# EAGLE board Z80_BMO_V1.2 (EAGLE 6.6.0), part 1 of 2
DRAWING_NUMBER: S002_B003; DRAWN: Mario Blunk / Blunk electronic; PROJECT: System TRAIN-Z; STATUS: PRODUCT
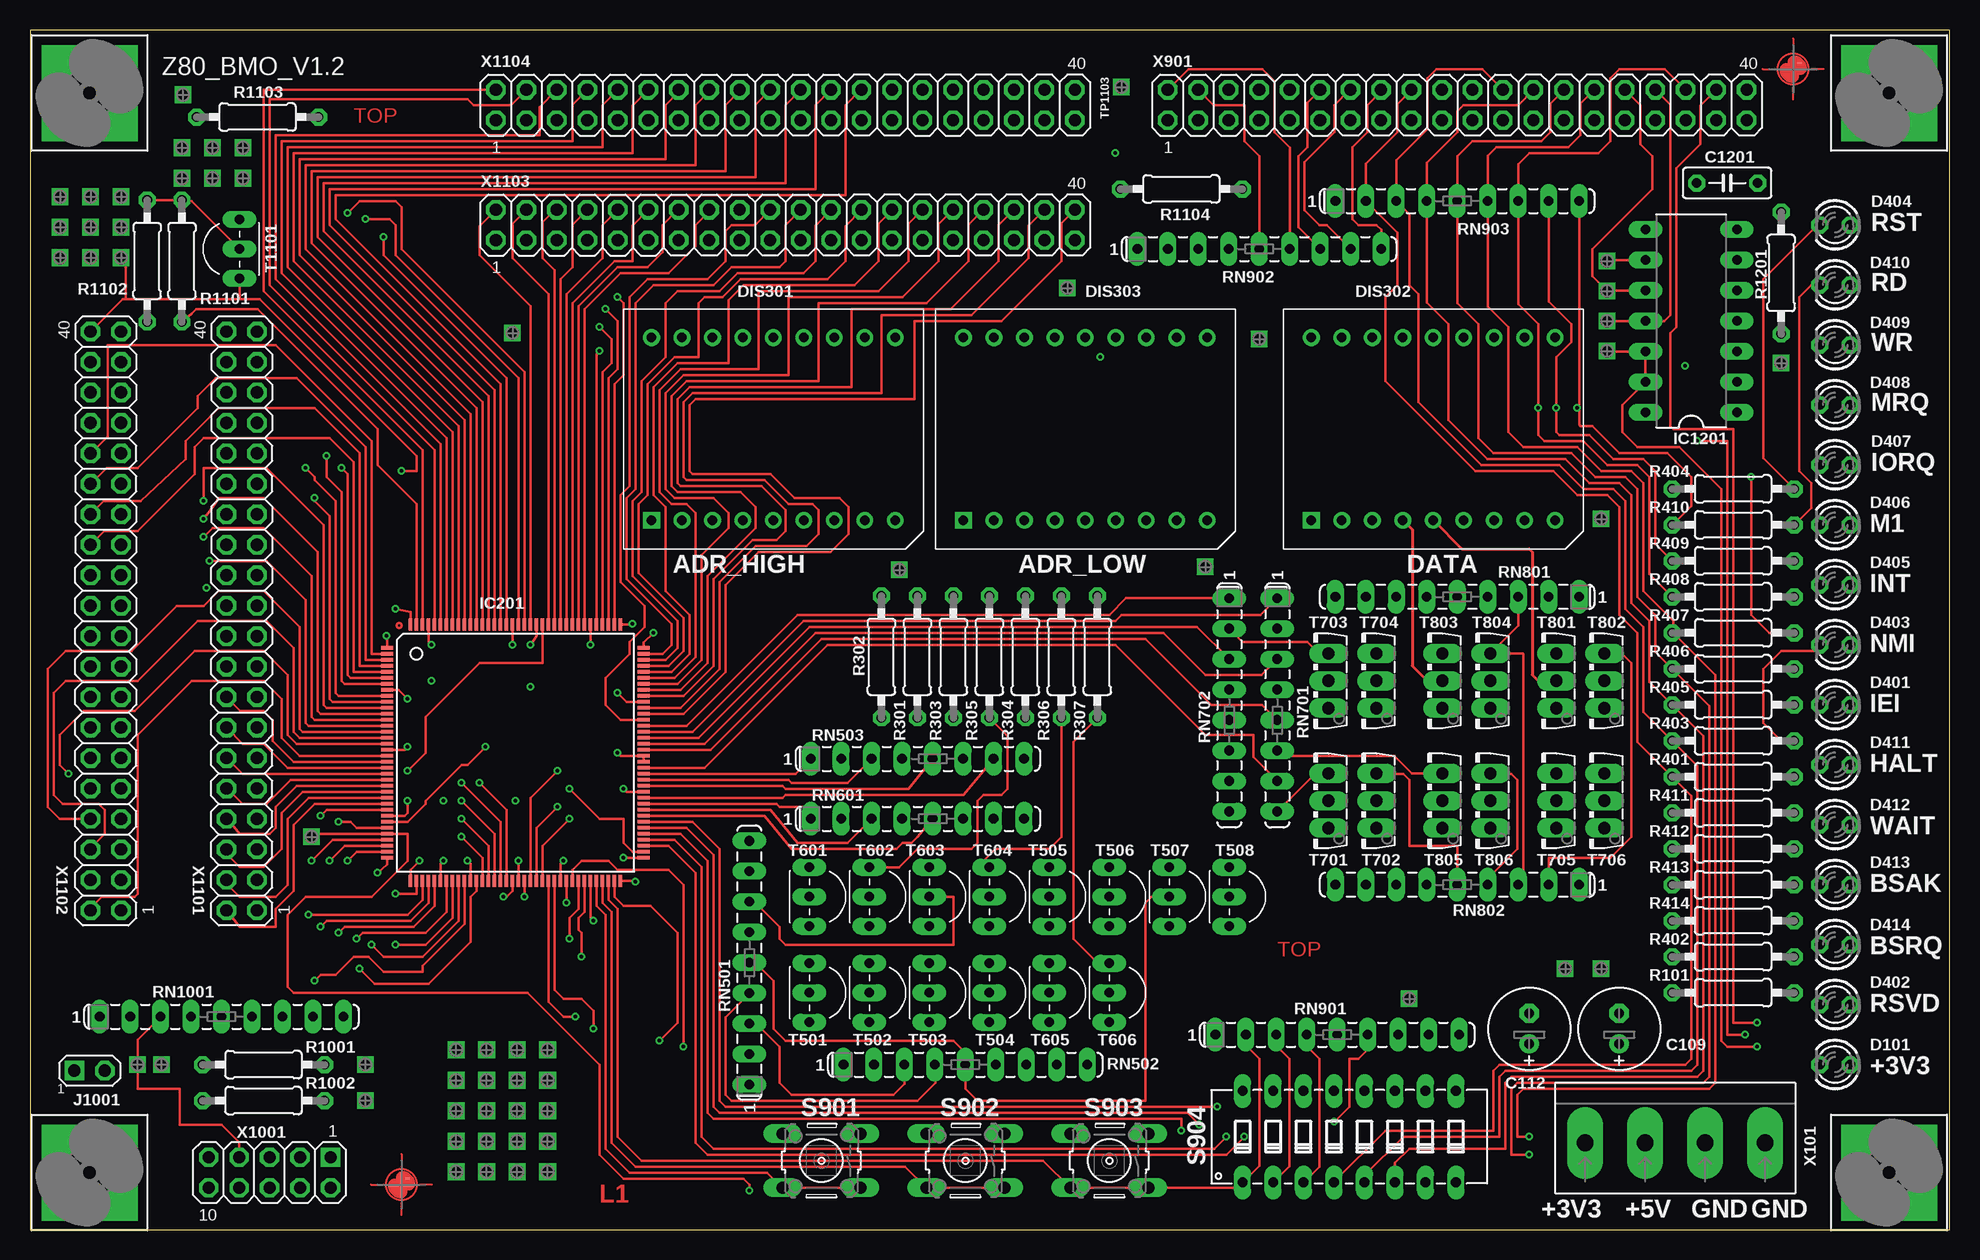
[diagram p12: board, top side]
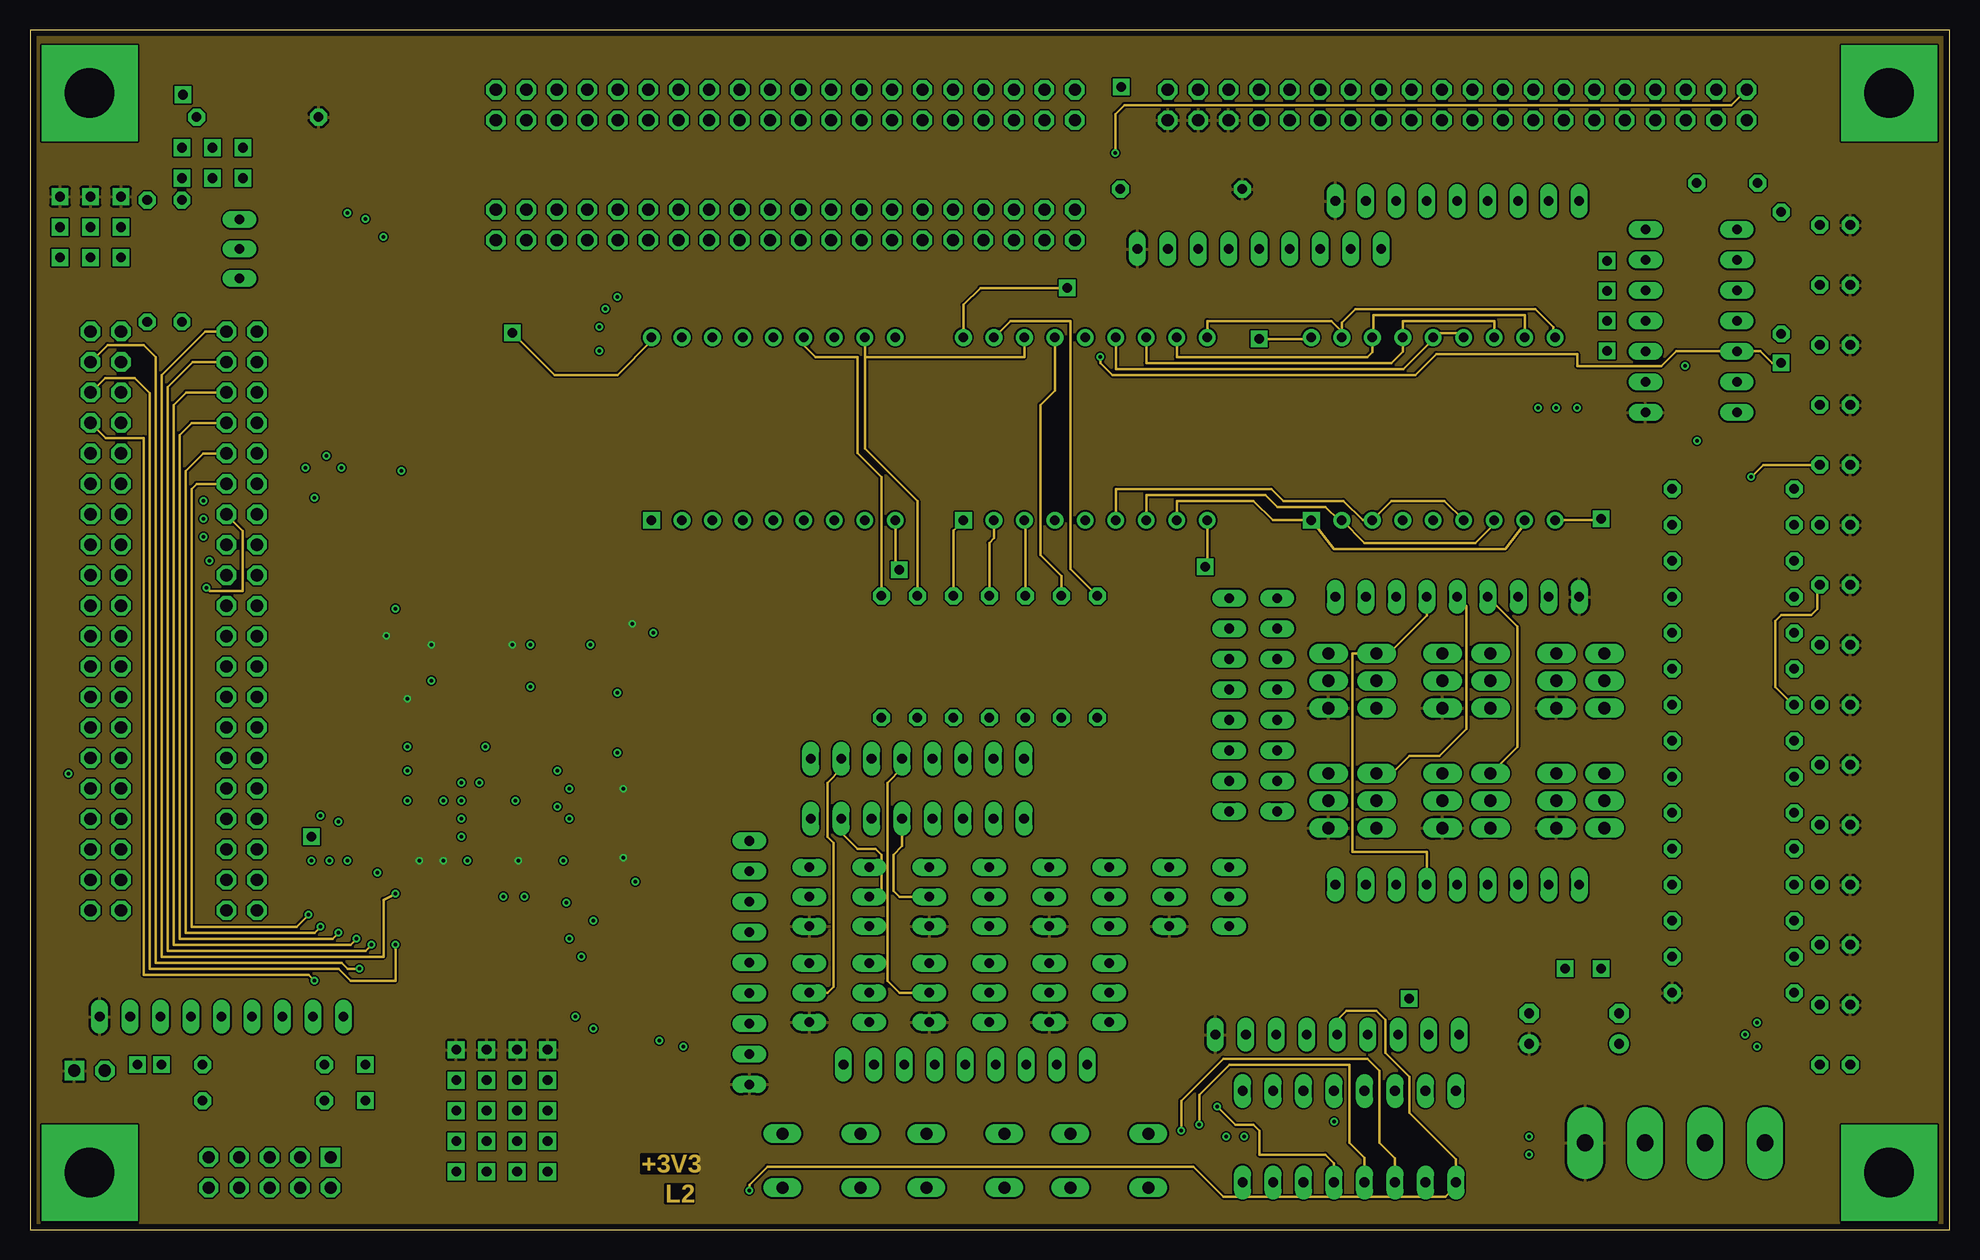
[diagram p13: board, inner layer Route2]
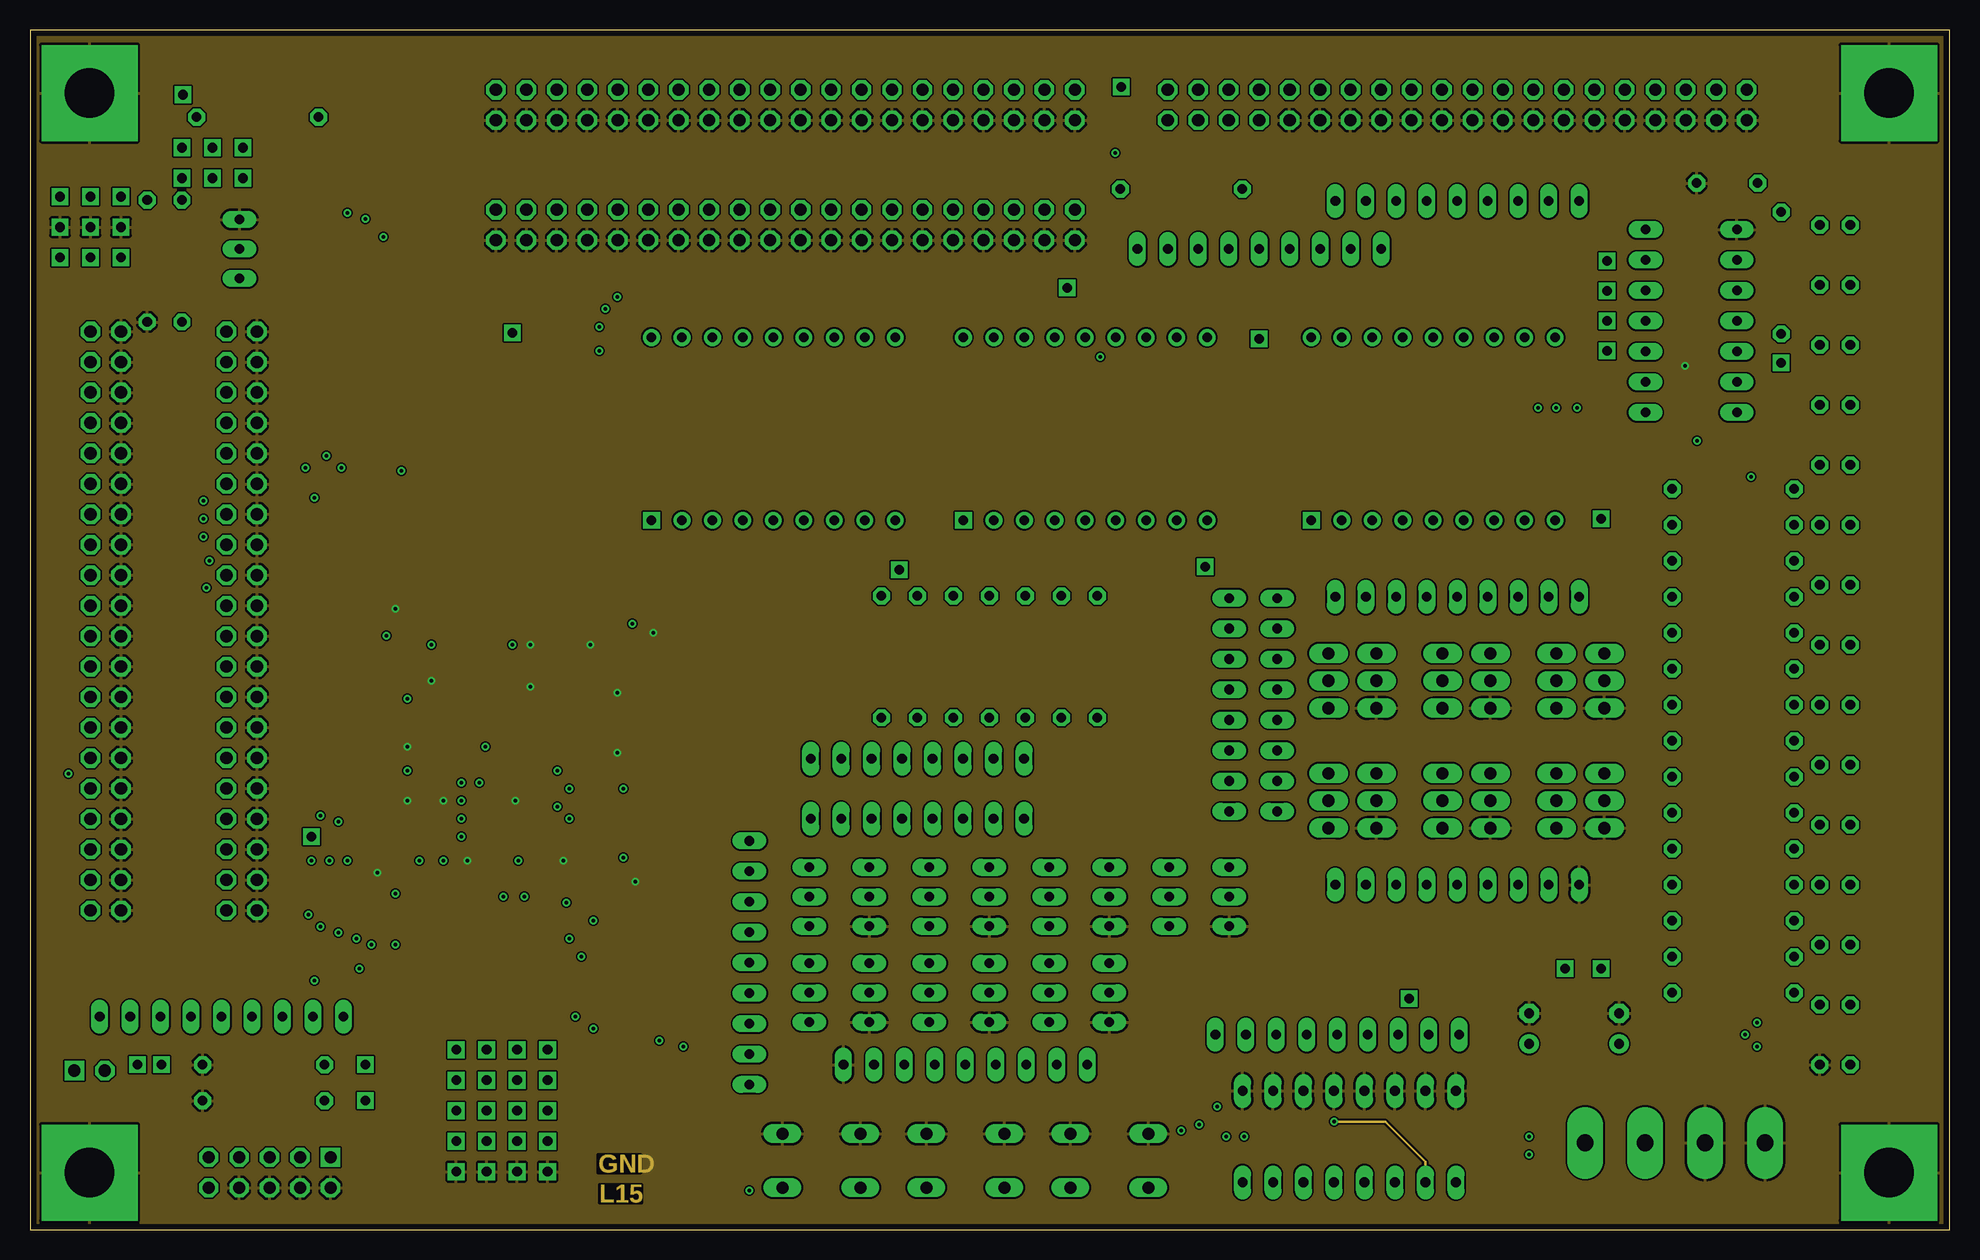
[diagram p14: board, inner layer Route15]
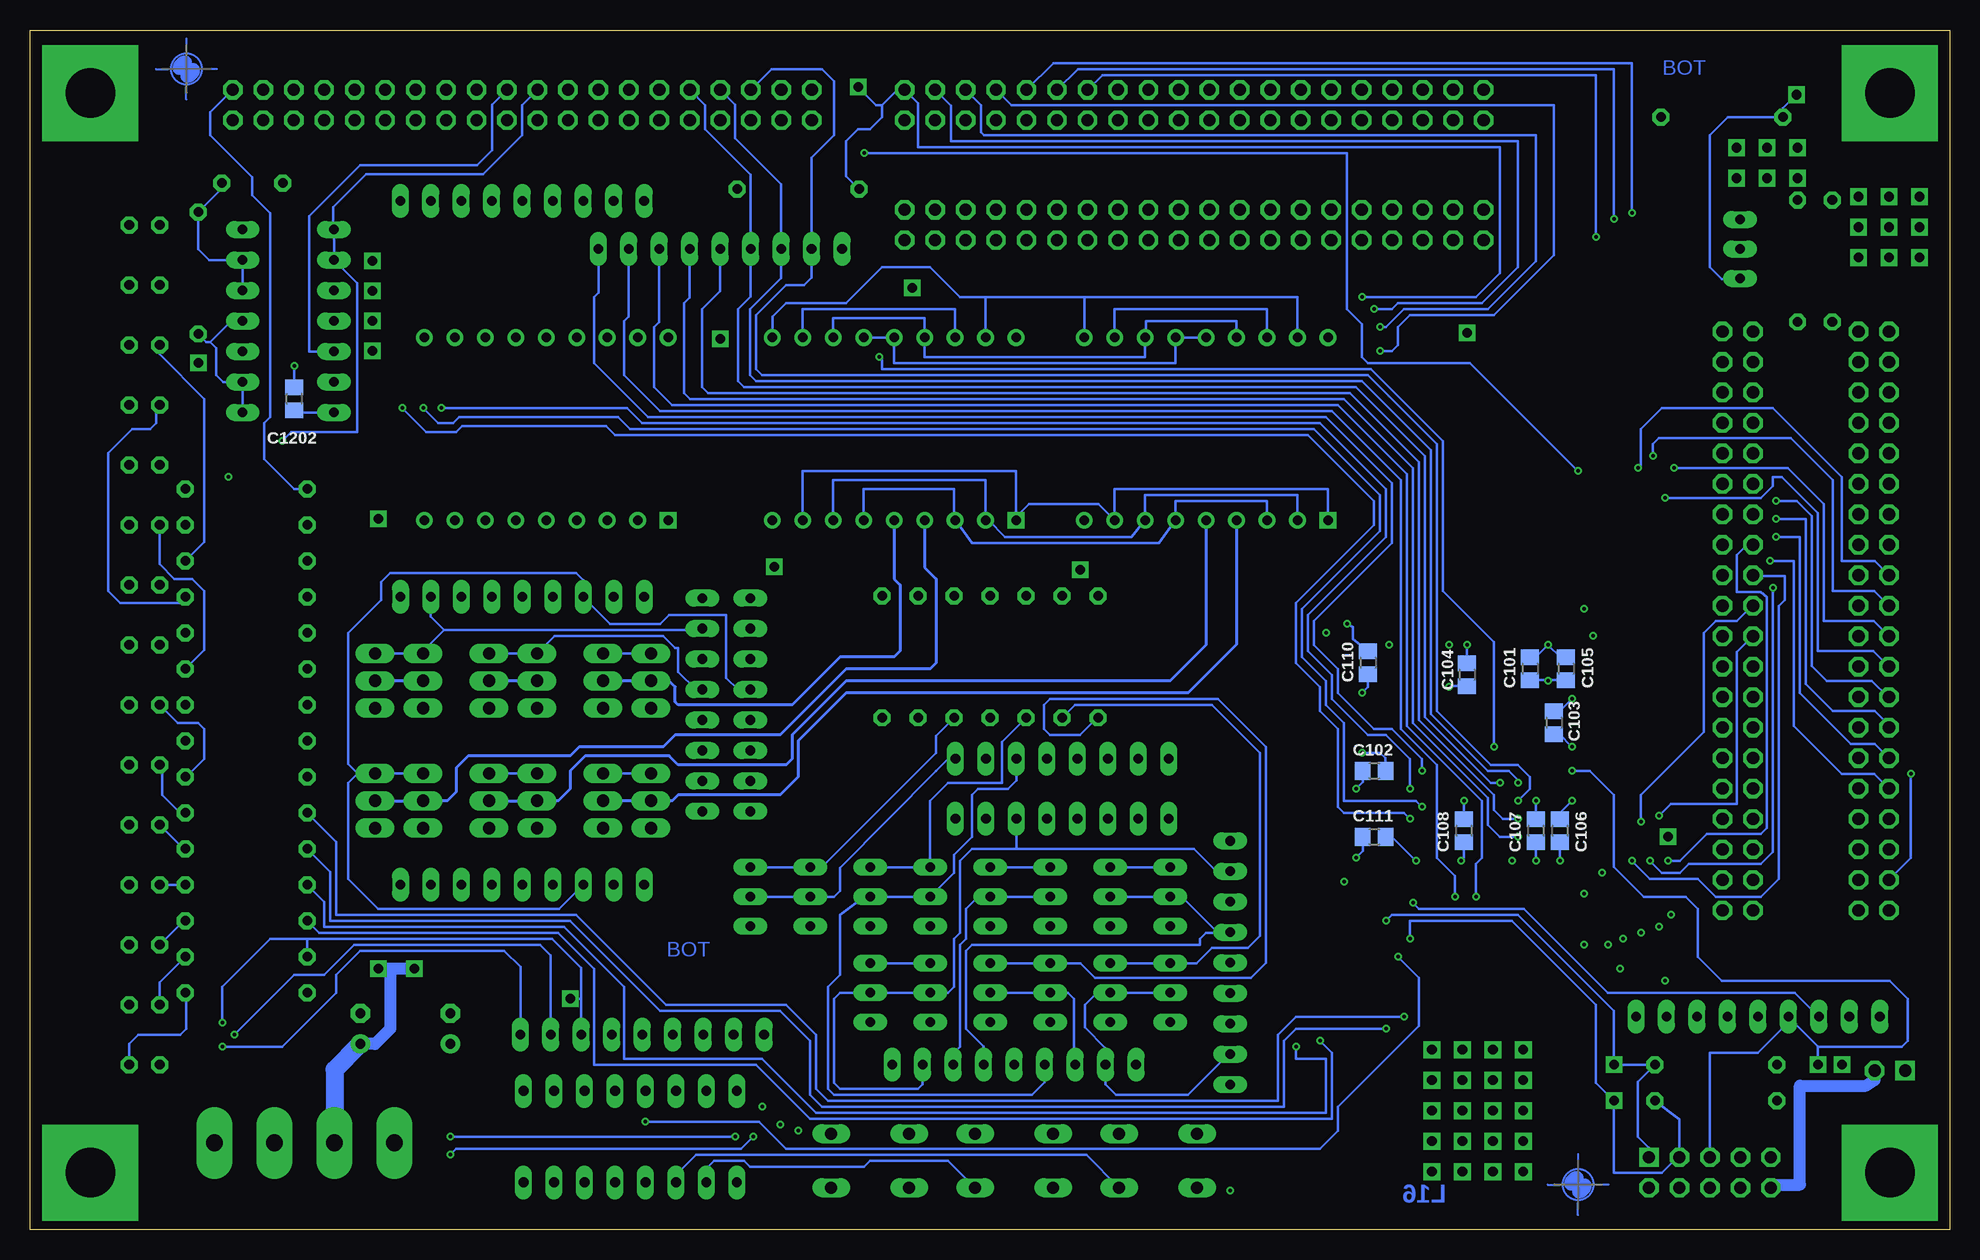
[diagram p15: board, bottom side, seen from below]

Size 160 x 100 mm. Coordinates in mm from the lower left corner, seen from the top.
Outline: 160,100 0,100 0,0 160,0 160,100
Copper layers (1+2*15+16): Top 0.035mm / dielectric 0.2mm / Route2 0.035mm / dielectric 1mm / Route15 0.035mm / dielectric 0.2mm / Bottom 0.035mm
Design rules "JLP_ML4_std": minimum track width 0.15mm, minimum drill 0.25mm, track to track 0.15mm, track to pad 0.15mm, pad to pad 0.15mm, via to via 0.15mm, smd to smd 0.15mm, copper to edge 0.5mm, drill to drill 0.2mm, minimum pad ring 0.3mm, minimum via ring 0.15mm, stop-mask expansion 0.075mm, vias tented up to drill 0.3mm, thermal gap 0.2mm

## Footprints (pad centres in the part's own frame; a part is rotated, then mirrored left to right if it is on the bottom)
S_0805 = smd 1.3 x 1.5: 1 -0.95,0; 2 0.95,0
T_RADIAL_7MM_GRID_2.54MM = drill 0.813 pad 1.6: + -1.27,0 | drill 0.813 pad 1.6 octagon: - 1.27,0
T_7X3MM_GRID_5MM = drill 0.813 octagon: 1 -2.54,0; 2 2.54,0
T_LED_3MM = drill 0.813 octagon: A -1.27,0; C 1.27,0
T_VQE_XX_2DIGIT = drill 0.8 square: 1 -10.16,-7.62 | drill 0.8: 2 -7.62,-7.62; 3 -5.08,-7.62; 4 -2.54,-7.62; 5 0,-7.62; 6 2.54,-7.62; 7 5.08,-7.62; 8 7.62,-7.62; 9 10.16,-7.62; 10 10.16,7.62; 11 7.62,7.62; 12 5.08,7.62; 13 2.54,7.62; 14 0,7.62; 15 -2.54,7.62; 16 -5.08,7.62; 17 -7.62,7.62; 18 -10.16,7.62
CROSSHAIR = smd 0.305 x 0.152: 1 0.5,0.5
4.1_PAD = drill 4.1 pad 8 square: H1 0,0
S_TQFP144 = smd 1 x 0.3: 1 -10.7,8.75; 2 -10.7,8.25; 3 -10.7,7.75; 4 -10.7,7.25; 5 -10.7,6.75; 6 -10.7,6.25; 7 -10.7,5.75; 8 -10.7,5.25; 9 -10.7,4.75; 10 -10.7,4.25; 11 -10.7,3.75; 12 -10.7,3.25; 13 -10.7,2.75; 14 -10.7,2.25; 15 -10.7,1.75; 16 -10.7,1.25; 17 -10.7,0.75; 18 -10.7,0.25; 19 -10.7,-0.25; 20 -10.7,-0.75; 21 -10.7,-1.25; 22 -10.7,-1.75; 23 -10.7,-2.25; 24 -10.7,-2.75; 25 -10.7,-3.25; 26 -10.7,-3.75; 27 -10.7,-4.25; 28 -10.7,-4.75; 29 -10.7,-5.25; 30 -10.7,-5.75; 31 -10.7,-6.25; 32 -10.7,-6.75; 33 -10.7,-7.25; 34 -10.7,-7.75; 35 -10.7,-8.25; 36 -10.7,-8.75; 73 10.7,-8.75; 74 10.7,-8.25; 75 10.7,-7.75; 76 10.7,-7.25; 77 10.7,-6.75; 78 10.7,-6.25; 79 10.7,-5.75; 80 10.7,-5.25; 81 10.7,-4.75; 82 10.7,-4.25; 83 10.7,-3.75; 84 10.7,-3.25; 85 10.7,-2.75; 86 10.7,-2.25; 87 10.7,-1.75; 88 10.7,-1.25; 89 10.7,-0.75; 90 10.7,-0.25; 91 10.7,0.25; 92 10.7,0.75; 93 10.7,1.25; 94 10.7,1.75; 95 10.7,2.25; 96 10.7,2.75; 97 10.7,3.25; 98 10.7,3.75; 99 10.7,4.25; 100 10.7,4.75; 101 10.7,5.25; 102 10.7,5.75; 103 10.7,6.25; 104 10.7,6.75; 105 10.7,7.25; 106 10.7,7.75; 107 10.7,8.25; 108 10.7,8.75 | smd 0.3 x 1: 37 -8.75,-10.7; 38 -8.25,-10.7; 39 -7.75,-10.7; 40 -7.25,-10.7; 41 -6.75,-10.7; 42 -6.25,-10.7; 43 -5.75,-10.7; 44 -5.25,-10.7; 45 -4.75,-10.7; 46 -4.25,-10.7; 47 -3.75,-10.7; 48 -3.25,-10.7; 49 -2.75,-10.7; 50 -2.25,-10.7; 51 -1.75,-10.7; 52 -1.25,-10.7; 53 -0.75,-10.7; 54 -0.25,-10.7; 55 0.25,-10.7; 56 0.75,-10.7; 57 1.25,-10.7; 58 1.75,-10.7; 59 2.25,-10.7; 60 2.75,-10.7; 61 3.25,-10.7; 62 3.75,-10.7; 63 4.25,-10.7; 64 4.75,-10.7; 65 5.25,-10.7; 66 5.75,-10.7; 67 6.25,-10.7; 68 6.75,-10.7; 69 7.25,-10.7; 70 7.75,-10.7; 71 8.25,-10.7; 72 8.75,-10.7; 109 8.75,10.7; 110 8.25,10.7; 111 7.75,10.7; 112 7.25,10.7; 113 6.75,10.7; 114 6.25,10.7; 115 5.75,10.7; 116 5.25,10.7; 117 4.75,10.7; 118 4.25,10.7; 119 3.75,10.7; 120 3.25,10.7; 121 2.75,10.7; 122 2.25,10.7; 123 1.75,10.7; 124 1.25,10.7; 125 0.75,10.7; 126 0.25,10.7; 127 -0.25,10.7; 128 -0.75,10.7; 129 -1.25,10.7; 130 -1.75,10.7; 131 -2.25,10.7; 132 -2.75,10.7; 133 -3.25,10.7; 134 -3.75,10.7; 135 -4.25,10.7; 136 -4.75,10.7; 137 -5.25,10.7; 138 -5.75,10.7; 139 -6.25,10.7; 140 -6.75,10.7; 141 -7.25,10.7; 142 -7.75,10.7; 143 -8.25,10.7; 144 -8.75,10.7
T_NDIP14 = drill 0.8 long: 1 -7.62,-3.81; 2 -5.08,-3.81; 3 -2.54,-3.81; 4 0,-3.81; 5 2.54,-3.81; 6 5.08,-3.81; 7 7.62,-3.81; 8 7.62,3.81; 9 5.08,3.81; 10 2.54,3.81; 11 0,3.81; 12 -2.54,3.81; 13 -5.08,3.81; 14 -7.62,3.81
T_MALE_2X1_VERTICAL = drill 1.016 square: 1 0,-1.27 | drill 1.016 octagon: 2 0,1.27
T_0207_GRID10MM = drill 0.813 octagon: 1 -5.08,0; 2 5.08,0
T_SIL9 = drill 0.813 long: 1 -10.16,0; 2 -7.62,0; 3 -5.08,0; 4 -2.54,0; 5 0,0; 6 2.54,0; 7 5.08,0; 8 7.62,0; 9 10.16,0
T_SIL8 = drill 0.813 long: 1 -8.89,0; 2 -6.35,0; 3 -3.81,0; 4 -1.27,0; 5 1.27,0; 6 3.81,0; 7 6.35,0; 8 8.89,0
T_PUSH_BUTTON_6X6 = drill 1 long: 1 -3.25,2.25; 2 -3.25,-2.25; 3 3.25,2.25; 4 3.25,-2.25
T_DIP08 = drill 0.813 long: 1 -8.89,-3.81; 2 -6.35,-3.81; 3 -3.81,-3.81; 4 -1.27,-3.81; 5 1.27,-3.81; 6 3.81,-3.81; 7 6.35,-3.81; 8 8.89,-3.81; 9 8.89,3.81; 10 6.35,3.81; 11 3.81,3.81; 12 1.27,3.81; 13 -1.27,3.81; 14 -3.81,3.81; 15 -6.35,3.81; 16 -8.89,3.81
T_TO92-CBE = drill 0.813 long: B 0,0; C 2.46,0; E -2.46,0
T_TO126_VERTICAL = drill 1.016 long: B 2.286,-1.27; C 0,-1.27; E -2.286,-1.27
T_TEST_POINT_SMALL = drill 0.8 square: 1 0,0
T_WIRE_CLAMP_1X4_5MM = drill 1.4 pad 3 long: 1 -7.5,-0.02; 2 -2.5,-0.02; 3 2.5,-0.02; 4 7.5,-0.02
T_MALE_2X20_VERTICAL = drill 1.016 octagon: 1 -24.13,-1.27; 2 -24.13,1.27; 3 -21.59,-1.27; 4 -21.59,1.27; 5 -19.05,-1.27; 6 -19.05,1.27; 7 -16.51,-1.27; 8 -16.51,1.27; 9 -13.97,-1.27; 10 -13.97,1.27; 11 -11.43,-1.27; 12 -11.43,1.27; 13 -8.89,-1.27; 14 -8.89,1.27; 15 -6.35,-1.27; 16 -6.35,1.27; 17 -3.81,-1.27; 18 -3.81,1.27; 19 -1.27,-1.27; 20 -1.27,1.27; 21 1.27,-1.27; 22 1.27,1.27; 23 3.81,-1.27; 24 3.81,1.27; 25 6.35,-1.27; 26 6.35,1.27; 27 8.89,-1.27; 28 8.89,1.27; 29 11.43,-1.27; 30 11.43,1.27; 31 13.97,-1.27; 32 13.97,1.27; 33 16.51,-1.27; 34 16.51,1.27; 35 19.05,-1.27; 36 19.05,1.27; 37 21.59,-1.27; 38 21.59,1.27; 39 24.13,-1.27; 40 24.13,1.27
T_MALE_2X5_VERTICAL = drill 1 square: 1 -5.08,-1.27 | drill 1 octagon: 2 -5.08,1.27; 3 -2.54,-1.27; 4 -2.54,1.27; 5 0,-1.27; 6 0,1.27; 7 2.54,-1.27; 8 2.54,1.27; 9 5.08,-1.27; 10 5.08,1.27

## Placement (x,y rotation side)
C101  100n  [S_0805]  34.97,46.74 270 bottom
C102  100n  [S_0805]  47.97,38.24 0 bottom
C103  100n  [S_0805]  32.97,42.24 270 bottom
C104  100n  [S_0805]  40.22,46.24 270 bottom
C105  100n  [S_0805]  31.96,46.74 270 bottom
C106  100n  [S_0805]  32.47,33.24 90 bottom
C107  100n  [S_0805]  34.47,33.24 90 bottom
C108  100n  [S_0805]  40.47,33.24 90 bottom
C109  100u  [T_RADIAL_7MM_GRID_2.54MM]  132.47,16.75 90 top
C110  100n  [S_0805]  48.47,47.24 270 bottom
C111  100n  [S_0805]  47.97,32.74 0 bottom
C112  100u  [T_RADIAL_7MM_GRID_2.54MM]  124.97,16.75 90 top
C1201  4n7  [T_7X3MM_GRID_5MM]  141.47,87.25 180 top
C1202  100n  [S_0805]  137.97,69.25 90 bottom
D101  green  [T_LED_3MM]  150.47,13.74 180 top
D401  green  [T_LED_3MM]  150.47,43.74 180 top
D402  green  [T_LED_3MM]  150.47,18.75 180 top
D403  green  [T_LED_3MM]  150.47,48.74 180 top
D404  red  [T_LED_3MM]  150.47,83.75 180 top
D405  green  [T_LED_3MM]  150.47,53.74 180 top
D406  green  [T_LED_3MM]  150.47,58.74 180 top
D407  green  [T_LED_3MM]  150.47,63.74 180 top
D408  green  [T_LED_3MM]  150.47,68.75 180 top
D409  green  [T_LED_3MM]  150.47,73.75 180 top
D410  green  [T_LED_3MM]  150.47,78.75 180 top
D411  green  [T_LED_3MM]  150.47,38.74 180 top
D412  green  [T_LED_3MM]  150.47,33.74 180 top
D413  green  [T_LED_3MM]  150.47,28.75 180 top
D414  green  [T_LED_3MM]  150.47,23.75 180 top
DIS301  VQE24  [T_VQE_XX_2DIGIT]  61.97,66.75 0 top
DIS302  VQE14  [T_VQE_XX_2DIGIT]  116.97,66.75 0 top
DIS303  VQE24  [T_VQE_XX_2DIGIT]  87.97,66.75 0 top
DRILEGEND  [DRILEGEND]  182.95,-0.08 0 top  (outside the outline)
FD101  FIDUCIAL_CROSSHAIR  [CROSSHAIR]  146.97,96.75 0 top
FD102  FIDUCIAL_CROSSHAIR  [CROSSHAIR]  30.96,3.75 0 top
H101  HOLE_4.1_PAD  [4.1_PAD]  4.96,4.75 0 top
H102  HOLE_4.1_PAD  [4.1_PAD]  4.96,94.75 0 top
H103  HOLE_4.1_PAD  [4.1_PAD]  154.97,4.75 0 top
H104  HOLE_4.1_PAD  [4.1_PAD]  154.97,94.75 0 top
IC201  XC95288XL-xTQ144x  [S_TQFP144]  40.47,39.74 0 top
IC1201  4093N  [T_NDIP14]  138.47,75.75 90 top
J1001  [T_MALE_2X1_VERTICAL]  4.96,13.24 270 top
R101  160  [T_0207_GRID10MM]  141.97,19.75 180 top
R301  10  [T_0207_GRID10MM]  73.97,47.74 270 top
R302  10  [T_0207_GRID10MM]  70.97,47.74 270 top
R303  10  [T_0207_GRID10MM]  76.97,47.74 270 top
R304  10  [T_0207_GRID10MM]  82.97,47.74 270 top
R305  10  [T_0207_GRID10MM]  79.97,47.74 270 top
R306  10  [T_0207_GRID10MM]  85.97,47.74 270 top
R307  10  [T_0207_GRID10MM]  88.97,47.74 270 top
R401  160  [T_0207_GRID10MM]  141.97,37.74 180 top
R402  160  [T_0207_GRID10MM]  141.97,22.75 180 top
R403  160  [T_0207_GRID10MM]  141.97,40.74 180 top
R404  160  [T_0207_GRID10MM]  141.97,61.74 180 top
R405  160  [T_0207_GRID10MM]  141.97,43.74 180 top
R406  160  [T_0207_GRID10MM]  141.97,46.74 180 top
R407  160  [T_0207_GRID10MM]  141.97,49.74 180 top
R408  160  [T_0207_GRID10MM]  141.97,52.74 180 top
R409  160  [T_0207_GRID10MM]  141.97,55.74 180 top
R410  160  [T_0207_GRID10MM]  141.97,58.74 180 top
R411  160  [T_0207_GRID10MM]  141.97,34.74 180 top
R412  160  [T_0207_GRID10MM]  141.97,31.75 180 top
R413  160  [T_0207_GRID10MM]  141.97,28.75 180 top
R414  160  [T_0207_GRID10MM]  141.97,25.75 180 top
R1001  300  [T_0207_GRID10MM]  19.46,13.74 180 top
R1002  300  [T_0207_GRID10MM]  19.46,10.74 180 top
R1101  2k7  [T_0207_GRID10MM]  12.66,80.75 270 top
R1102  10k  [T_0207_GRID10MM]  9.77,80.75 270 top
R1103  300  [T_0207_GRID10MM]  18.96,92.75 180 top
R1104  300  [T_0207_GRID10MM]  95.97,86.75 180 top
R1201  10k  [T_0207_GRID10MM]  145.97,79.75 90 top
RN501  10k  [T_SIL9]  59.97,22.25 90 top
RN502  10k  [T_SIL9]  77.97,13.74 0 top
RN503  2k7  [T_SIL8]  73.97,39.24 0 top
RN601  2k7  [T_SIL8]  73.97,34.24 0 top
RN701  100  [T_SIL8]  103.97,43.74 270 top
RN702  100  [T_SIL8]  99.97,43.74 270 top
RN801  10k  [T_SIL9]  118.97,52.74 180 top
RN802  10k  [T_SIL9]  118.97,28.75 180 top
RN901  10k  [T_SIL9]  108.97,16.25 0 top
RN902  10k  [T_SIL9]  102.47,81.75 0 top
RN903  10k  [T_SIL9]  118.97,85.75 0 top
RN1001  10k  [T_SIL9]  15.96,17.75 0 top
S901  [T_PUSH_BUTTON_6X6]  65.97,5.75 180 top
S902  [T_PUSH_BUTTON_6X6]  77.97,5.75 180 top
S903  [T_PUSH_BUTTON_6X6]  89.97,5.75 180 top
S904  [T_DIP08]  109.97,7.75 0 top
T501  BC327  [T_TO92-CBE]  64.97,19.75 90 top
T502  BC548C  [T_TO92-CBE]  69.97,19.75 90 top
T503  BC327  [T_TO92-CBE]  74.97,19.75 90 top
T504  BC548C  [T_TO92-CBE]  79.97,19.75 90 top
T505  BC327  [T_TO92-CBE]  84.97,27.75 90 top
T506  BC548C  [T_TO92-CBE]  89.97,27.75 90 top
T507  BC327  [T_TO92-CBE]  94.97,27.75 90 top
T508  BC548C  [T_TO92-CBE]  99.97,27.75 90 top
T601  BC327  [T_TO92-CBE]  64.97,27.75 90 top
T602  BC548C  [T_TO92-CBE]  69.97,27.75 90 top
T603  BC327  [T_TO92-CBE]  74.97,27.75 90 top
T604  BC548C  [T_TO92-CBE]  79.97,27.75 90 top
T605  BC327  [T_TO92-CBE]  84.97,19.75 90 top
T606  BC548C  [T_TO92-CBE]  89.97,19.75 90 top
T701  BD136  [T_TO126_VERTICAL]  106.97,35.74 90 top
T702  BD135  [T_TO126_VERTICAL]  110.97,35.74 90 top
T703  BD136  [T_TO126_VERTICAL]  106.97,45.74 90 top
T704  BD135  [T_TO126_VERTICAL]  110.97,45.74 90 top
T705  BD136  [T_TO126_VERTICAL]  125.97,35.74 90 top
T706  BD135  [T_TO126_VERTICAL]  129.97,35.74 90 top
T801  BD136  [T_TO126_VERTICAL]  125.97,45.74 90 top
T802  BD135  [T_TO126_VERTICAL]  129.97,45.74 90 top
T803  BD136  [T_TO126_VERTICAL]  116.47,45.74 90 top
T804  BD135  [T_TO126_VERTICAL]  120.47,45.74 90 top
T805  BD136  [T_TO126_VERTICAL]  116.47,35.74 90 top
T806  BD135  [T_TO126_VERTICAL]  120.47,35.74 90 top
T1101  BC548C  [T_TO92-CBE]  17.46,81.75 270 top
TP101  [T_TEST_POINT_SMALL]  130.97,21.75 0 top
TP102  [T_TEST_POINT_SMALL]  127.97,21.75 0 top
TP103  [T_TEST_POINT_SMALL]  35.53,4.83 90 top
TP104  [T_TEST_POINT_SMALL]  38.07,4.83 90 top
TP105  [T_TEST_POINT_SMALL]  40.61,4.83 90 top
TP106  [T_TEST_POINT_SMALL]  43.15,4.83 90 top
TP107  [T_TEST_POINT_SMALL]  35.53,14.98 90 top
TP108  [T_TEST_POINT_SMALL]  38.07,14.98 90 top
TP109  [T_TEST_POINT_SMALL]  40.61,14.98 90 top
TP110  [T_TEST_POINT_SMALL]  43.15,14.98 90 top
TP111  [T_TEST_POINT_SMALL]  5.04,81.03 0 top
TP112  [T_TEST_POINT_SMALL]  17.75,90.19 0 top
TP113  [T_TEST_POINT_SMALL]  15.21,90.19 0 top
TP114  [T_TEST_POINT_SMALL]  2.5,81.03 0 top
TP115  [T_TEST_POINT_SMALL]  2.5,86.11 0 top
TP116  [T_TEST_POINT_SMALL]  5.04,86.11 0 top
TP117  [T_TEST_POINT_SMALL]  7.58,86.11 0 top
TP118  [T_TEST_POINT_SMALL]  12.66,90.19 0 top
TP119  [T_TEST_POINT_SMALL]  12.66,87.65 0 top
TP120  [T_TEST_POINT_SMALL]  15.21,87.65 0 top
TP121  [T_TEST_POINT_SMALL]  17.75,87.65 0 top
TP122  [T_TEST_POINT_SMALL]  35.53,12.44 90 top
TP123  [T_TEST_POINT_SMALL]  38.07,12.44 90 top
TP124  [T_TEST_POINT_SMALL]  40.61,12.44 90 top
TP125  [T_TEST_POINT_SMALL]  43.15,12.44 90 top
TP126  [T_TEST_POINT_SMALL]  35.53,9.9 90 top
TP127  [T_TEST_POINT_SMALL]  5.04,83.56 0 top
TP128  [T_TEST_POINT_SMALL]  7.58,83.56 0 top
TP129  [T_TEST_POINT_SMALL]  2.5,83.56 0 top
TP130  [T_TEST_POINT_SMALL]  38.07,9.9 90 top
TP131  [T_TEST_POINT_SMALL]  40.61,9.9 90 top
TP132  [T_TEST_POINT_SMALL]  43.15,9.9 90 top
TP133  [T_TEST_POINT_SMALL]  35.53,7.37 90 top
TP134  [T_TEST_POINT_SMALL]  38.07,7.37 90 top
TP135  [T_TEST_POINT_SMALL]  40.61,7.37 90 top
TP136  [T_TEST_POINT_SMALL]  43.15,7.37 90 top
TP201  [T_TEST_POINT_SMALL]  23.46,32.74 0 top
TP301  [T_TEST_POINT_SMALL]  40.22,74.75 0 top
TP302  [T_TEST_POINT_SMALL]  102.47,74.25 0 top
TP303  [T_TEST_POINT_SMALL]  72.47,54.99 0 top
TP304  [T_TEST_POINT_SMALL]  130.97,59.24 0 top
TP305  [T_TEST_POINT_SMALL]  86.47,78.5 0 top
TP306  [T_TEST_POINT_SMALL]  97.97,55.24 0 top
TP901  [T_TEST_POINT_SMALL]  114.97,19.25 0 top
TP1001  [T_TEST_POINT_SMALL]  27.96,13.74 180 top
TP1002  [T_TEST_POINT_SMALL]  27.96,10.74 180 top
TP1003  [T_TEST_POINT_SMALL]  10.96,13.74 180 top
TP1004  [T_TEST_POINT_SMALL]  8.96,13.74 180 top
TP1101  [T_TEST_POINT_SMALL]  7.58,81.03 0 top
TP1102  [T_TEST_POINT_SMALL]  12.74,94.61 0 top
TP1103  [T_TEST_POINT_SMALL]  90.97,95.25 0 top
TP1201  [T_TEST_POINT_SMALL]  145.97,72.25 0 top
TP1202  [T_TEST_POINT_SMALL]  131.47,78.25 90 top
TP1203  [T_TEST_POINT_SMALL]  131.47,75.75 90 top
TP1204  [T_TEST_POINT_SMALL]  131.47,80.75 90 top
TP1205  [T_TEST_POINT_SMALL]  131.47,73.25 90 top
U$1  [A4_LANDSCAPE]  -9.04,-66.25 0 top  (outside the outline)
X101  [T_WIRE_CLAMP_1X4_5MM]  137.12,7.25 0 top
X901  [T_MALE_2X20_VERTICAL]  118.97,93.75 0 top
X1001  [T_MALE_2X5_VERTICAL]  19.96,4.75 180 top
X1101  [T_MALE_2X20_VERTICAL]  17.65,50.73 90 top
X1102  [T_MALE_2X20_VERTICAL]  6.31,50.73 90 top
X1103  [T_MALE_2X20_VERTICAL]  62.97,83.75 0 top
X1104  [T_MALE_2X20_VERTICAL]  62.97,93.75 0 top